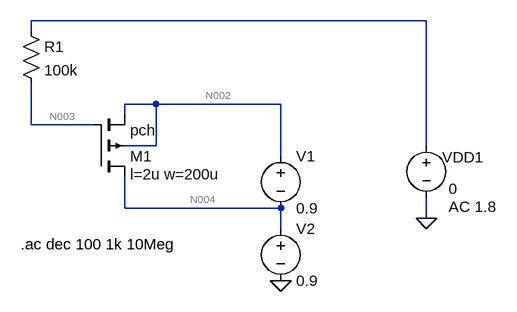
[diagram p0: schematic Draft1.asc]
Draft1.asc, the LTspice schematic file:
Version 4
SHEET 1 880 680
WIRE 512 -208 -96 -208
WIRE -96 -192 -96 -208
WIRE 96 -80 48 -80
WIRE 288 -80 96 -80
WIRE 48 -64 48 -80
WIRE -96 -48 -96 -112
WIRE 0 -48 -96 -48
WIRE 96 -16 96 -80
WIRE 96 -16 48 -16
WIRE 512 -16 512 -208
WIRE 288 0 288 -80
WIRE 48 80 48 32
WIRE 288 80 48 80
WIRE 512 96 512 64
WIRE 288 112 288 80
FLAG 288 192 0
FLAG 512 96 0
SYMBOL pmos4 0 32 M180
WINDOW 123 56 4 Left 2
SYMATTR InstName M1
SYMATTR Value pch
SYMATTR Value2 l=2u w=200u
SYMBOL voltage 512 -32 R0
WINDOW 0 24 34 Left 2
WINDOW 3 34 82 Left 2
WINDOW 123 34 110 Left 2
WINDOW 39 0 0 Left 0
SYMATTR InstName VDD1
SYMATTR Value 0
SYMATTR Value2 AC 1.8
SYMBOL res -112 -208 R0
SYMATTR InstName R1
SYMATTR Value 100k
SYMBOL voltage 288 -16 R0
WINDOW 123 0 0 Left 0
WINDOW 39 0 0 Left 0
SYMATTR InstName V1
SYMATTR Value 0.9
SYMBOL voltage 288 96 R0
WINDOW 123 0 0 Left 0
WINDOW 39 0 0 Left 0
SYMATTR InstName V2
SYMATTR Value 0.9
TEXT -112 136 Left 2 !.ac dec 100 1k 10Meg

The netlist it stands for:
* Draft1.asc
M1 N004 N003 N002 N002 pch l=2u w=200u
VDD1 N001 0 0 AC 1.8
R1 N001 N003 100k
V1 N002 N004 0.9
V2 N004 0 0.9
.model NMOS NMOS
.model PMOS PMOS
.lib standard.mos
.ac dec 100 1k 10Meg
.backanno
.end

* Results of the author's LTspice run, read from the files saved beside the schematic
* Operating Point, zero values left out:
*   V(n004) = 900 mV
*   V(n002) = 1.8 V
*   Id(M1) = -3.961 mA
*   Is(M1) = 3.961 mA
*   I(V1) = -3.961 mA
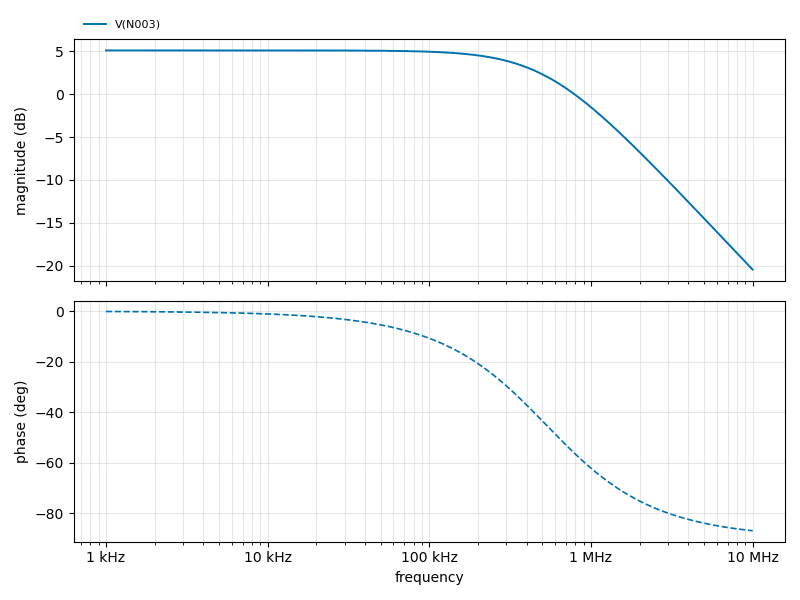
[diagram p1: AC Analysis of Draft1.asc, plotted from the saved traces]
* AC Analysis, 1 run:
*   V(N003): 5.11 dB at 1 kHz, -20.46 dB at 10 MHz, peak 5.11 dB at 1 kHz, 3 dB below the peak at 527.4 kHz